# EasyEDA Pro project ProProject_Lm317 powerDesign.epro

# Schematic Schematic1
Create Date: 2024-03-27; Page Name: P1; Project Name: Lm317 powerDesign; Schematic Name: Schematic1; Update Date: 2024-03-28; Company: ZenCoding.lumi; Page Size: A4; Version: V1.0
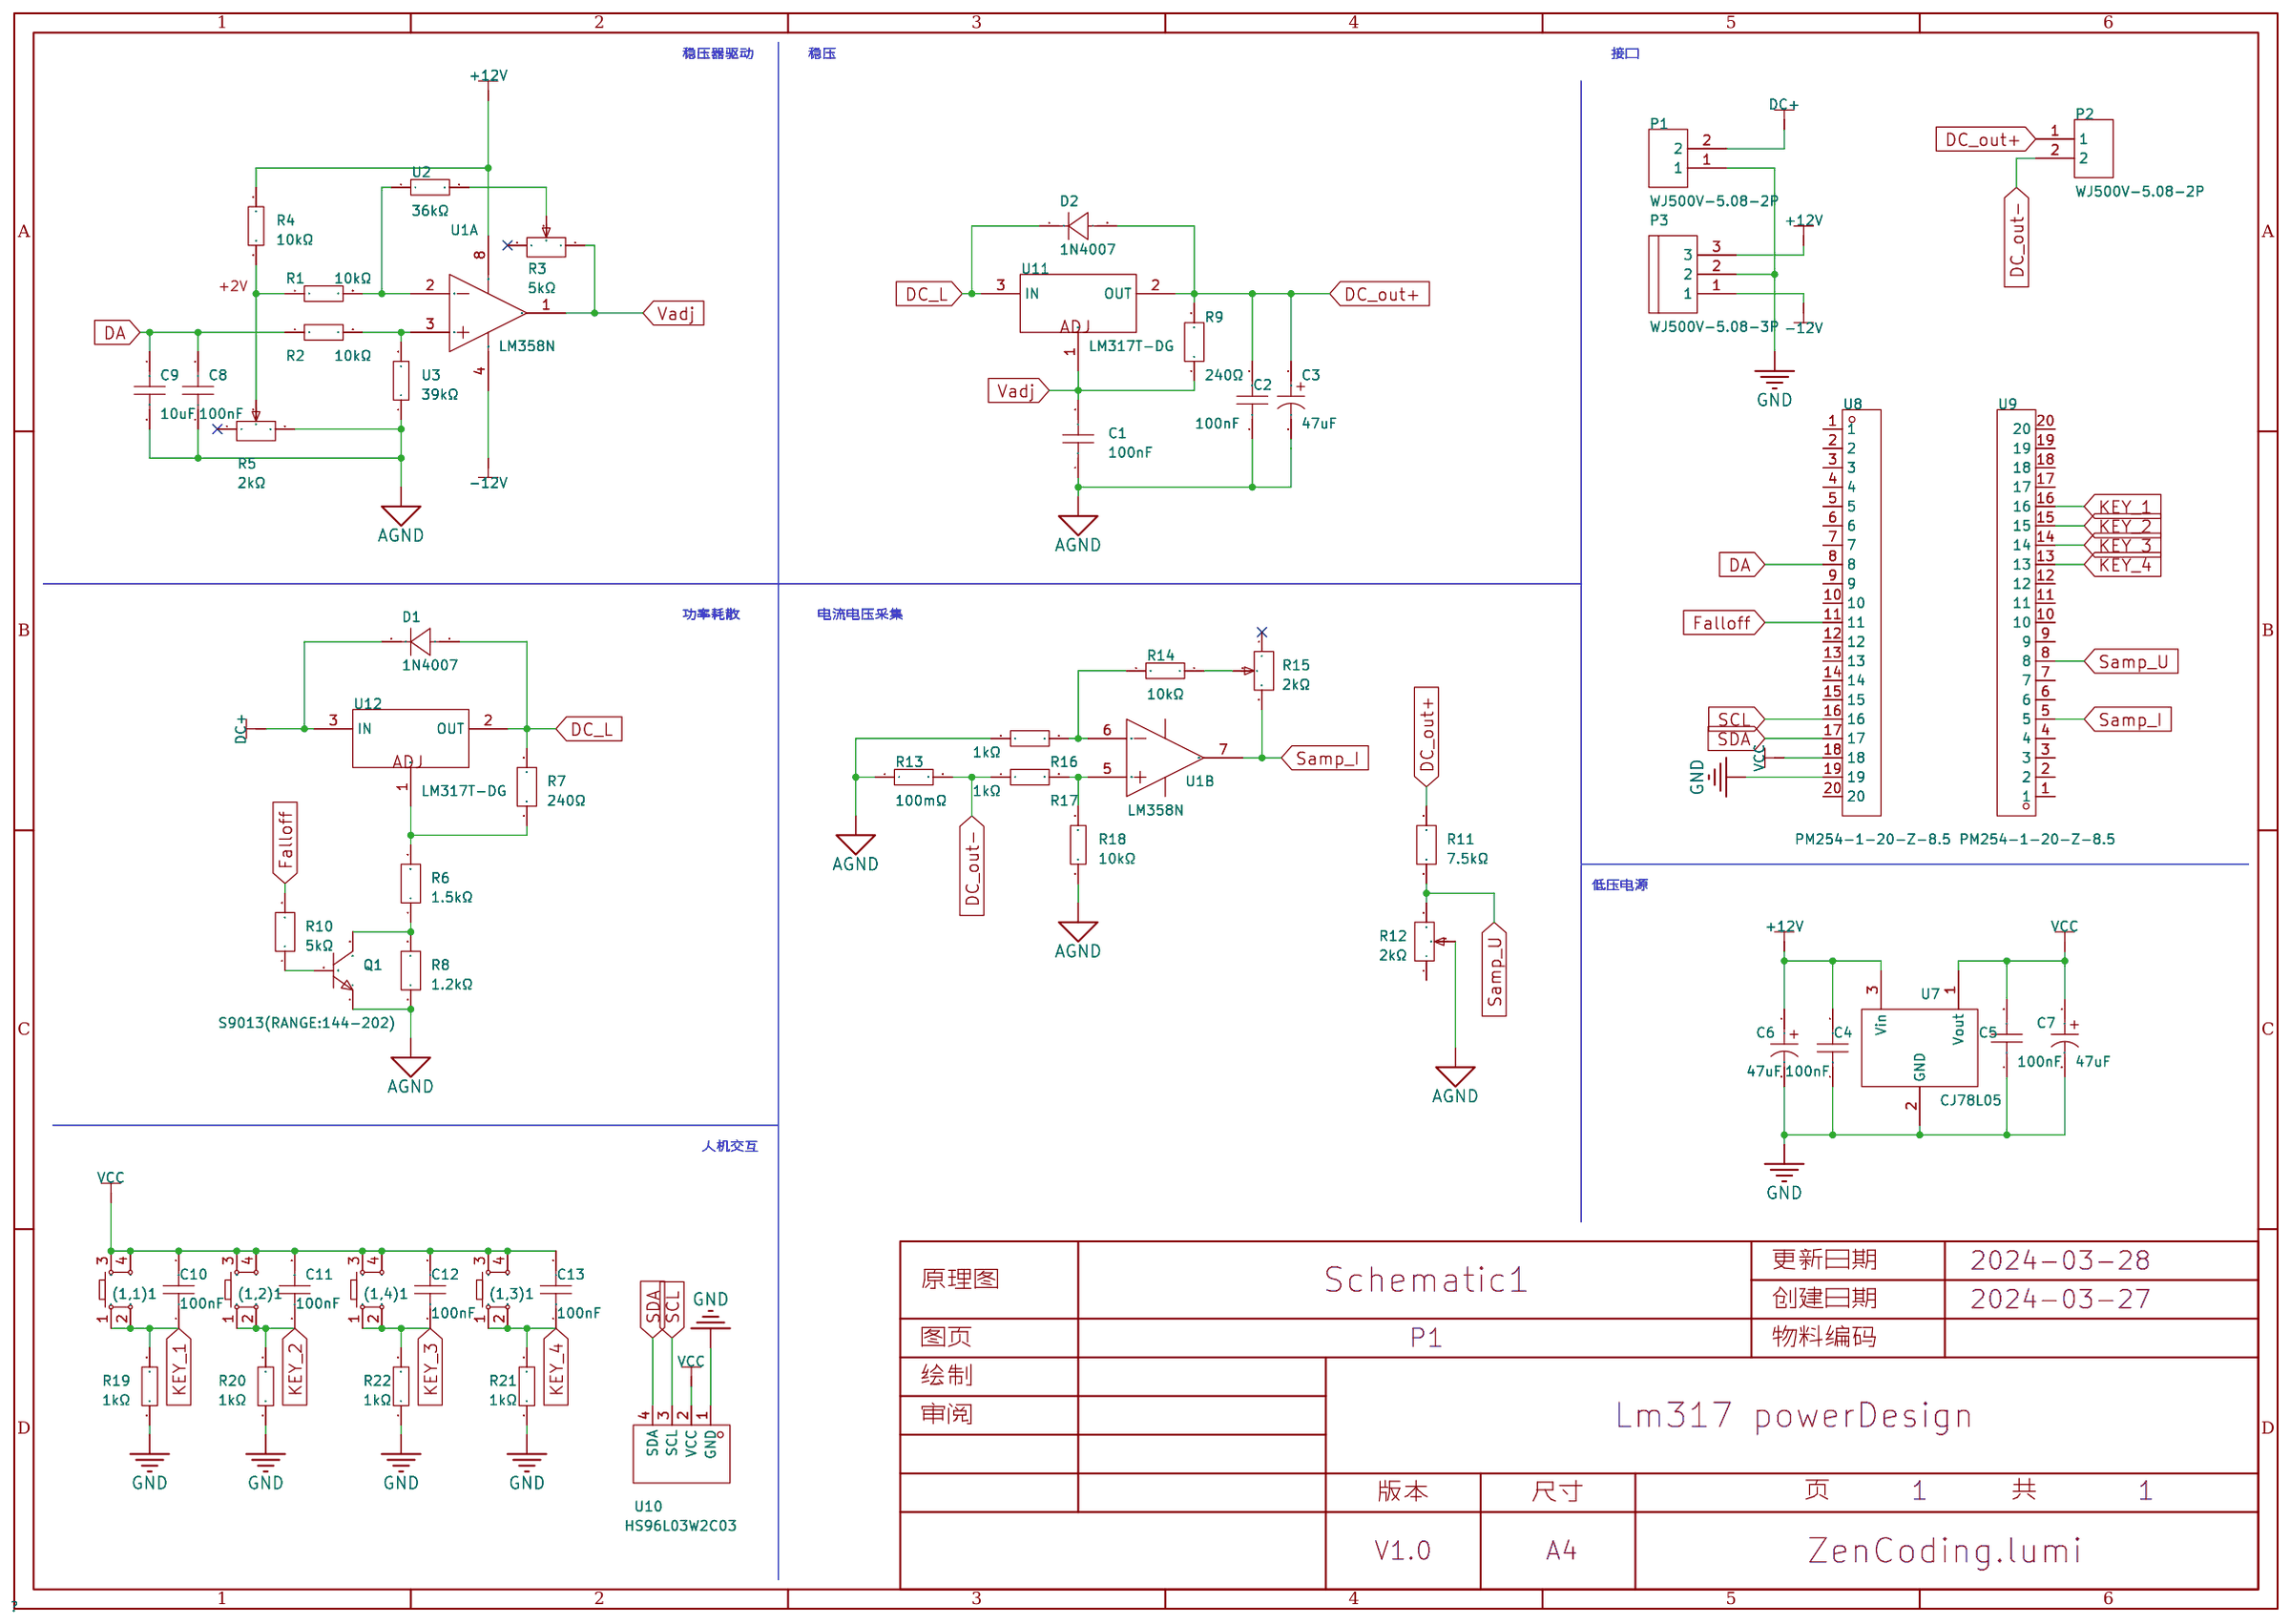
[diagram p0: schematic sheet]

## Parts
(1,1)1  -  [SW-TH_4P-L6.0-W6.0-P4.50-LS6.5]
(1,2)1  -  [SW-TH_4P-L6.0-W6.0-P4.50-LS6.5]
(1,3)1  -  [SW-TH_4P-L6.0-W6.0-P4.50-LS6.5]
(1,4)1  -  [SW-TH_4P-L6.0-W6.0-P4.50-LS6.5]
C1  100nF  [CAP-TH_L5.0-W2.5-P5.08-D0.7]
C2  100nF  [CAP-TH_L13.0-W6.0-P10.00-D0.6]
C3  47uF  [CAP-TH_BD6.3-P3.50-D0.5-FD]
C4  100nF  [CAP-TH_L5.0-W2.5-P5.08-D0.7]
C5  100nF  [CAP-TH_L5.0-W2.5-P5.08-D0.7]
C6  47uF  [CAP-TH_BD6.3-P3.50-D0.5-FD]
C7  47uF  [CAP-TH_BD6.3-P3.50-D0.5-FD]
C8  100nF  [CAP-TH_L5.0-W2.5-P5.08-D0.7]
C9  10uF  [CAP-TH_L5.5-W3.8-P3.50-D0.6]
C10  100nF  [CAP-TH_L5.0-W2.5-P5.08-D0.7]
C11  100nF  [CAP-TH_L5.0-W2.5-P5.08-D0.7]
C12  100nF  [CAP-TH_L5.0-W2.5-P5.08-D0.7]
C13  100nF  [CAP-TH_L5.0-W2.5-P5.08-D0.7]
D1  1N4007  [DO-41_BD2.4-L4.7-P8.70-D0.8-RD]
D2  1N4007  [DO-41_BD2.4-L4.7-P8.70-D0.8-RD]
P1  WJ500V-5.08-2P  [CONN-TH_2P-P5.00_WJ500V-5.08-2P]
P2  WJ500V-5.08-2P  [CONN-TH_2P-P5.00_WJ500V-5.08-2P]
P3  WJ500V-5.08-3P  [CONN-TH_3P-P5.00_WJ500V-5.08-3P]
Q1  S9013(RANGE:144-202)  [TO-92-3_L4.9-W3.7-P1.27-L]
R1  10kΩ  [RES-TH_BD2.4-L6.3-P10.30-D0.6]
R2  10kΩ  [RES-TH_BD2.4-L6.3-P10.30-D0.6]
R3  5kΩ  [RES-ADJ-TH_3296W]
R4  10kΩ  [RES-TH_BD2.4-L6.3-P10.30-D0.6]
R5  2kΩ  [RES-ADJ-TH_3296W]
R6  1.5kΩ  [RES-TH_BD2.7-L6.2-P10.20-D0.4]
R7  240Ω  [RES-TH_BD3.5-L9.0-P13.00-D0.5]
R8  1.2kΩ  [RES-TH_BD2.3-L6.5-P10.50-D0.5]
R9  240Ω  [RES-TH_BD3.5-L9.0-P13.00-D0.5]
R10  5kΩ  [RES-TH_BD4.5-L11.5-P15.50-D0.8]
R11  7.5kΩ  [RES-TH_BD2.3-L6.5-P10.50-D0.5]
R12  2kΩ  [RES-ADJ-TH_3296W]
R13  100mΩ  [R2512]
R14  10kΩ  [RES-TH_BD2.4-L6.3-P10.30-D0.6]
R15  2kΩ  [RES-ADJ-TH_3296W]
R16  1kΩ  [RES-TH_BD2.5-L6.5-P10.50-D0.6]
R17  1kΩ  [RES-TH_BD2.5-L6.5-P10.50-D0.6]
R18  10kΩ  [RES-TH_BD2.4-L6.3-P10.30-D0.6]
R19  1kΩ  [RES-TH_BD2.5-L6.5-P10.50-D0.6]
R20  1kΩ  [RES-TH_BD2.5-L6.5-P10.50-D0.6]
R21  1kΩ  [RES-TH_BD2.5-L6.5-P10.50-D0.6]
R22  1kΩ  [RES-TH_BD2.5-L6.5-P10.50-D0.6]
U1  LM358N  [DIP-8_L9.2-W6.3-P2.54-LS7.62-BL]  (sections 1,2)
U2  36kΩ  [RES-TH_BD2.7-L6.2-P10.20-D0.4]
U3  39kΩ  [RES-TH_BD2.7-L6.2-P10.20-D0.4]
U7  CJ78L05  [TO-92-3_L4.9-W3.7-P1.27-L]
U8  PM254-1-20-Z-8.5  [HDR-TH_20P-P2.54-V-F-2]
U9  PM254-1-20-Z-8.5  [HDR-TH_20P-P2.54-V-F-2]
U10  HS96L03W2C03  [OLED-TH_L27.8-W27.2-P2.54_C9900033791]
U11  LM317T-DG  [TO-220-3_L10.0-W4.5-P2.54-L]
U12  LM317T-DG  [TO-220-3_L10.0-W4.5-P2.54-L]

## Library data of the parts
(1,1)1 (1,2)1 (1,3)1 (1,4)1 = Key_TH_6x6x6: 触点电流:50mA;额定电压(DC):12V;绝缘电阻:100MΩ;电路结构:单刀单掷;安装方式:直插;按钮形状:圆形按钮;按钮/盖帽颜色:黑色;作用力:260gf@±30gf;工作温度:-25℃~+70℃;引脚样式:PC引脚;开关长度:6mm;开关宽度:6mm;开关高度:6mm;带支架:否;; Supplier Part: C2837516; Supplier Footprint: 插件
C1 C4 C5 C8 C10-C13 = CC2A104ZC1ID3F7C30MF: 容值:100nF;精度:-20%~+80%;额定电压:100V;温度系数:Y5V;; LCSC Part Name: 100nF -20%~+80% 100V; Supplier Part: C254109; Manufacturer: Dersonic(德尔创); Supplier Footprint: 插件,P=5.08mm; JLCPCB Part Class: 扩展库; Datasheet: https://atta.szlcsc.com/upload/public/pdf/source/20200826/C254109_69B66F26D881BAFE780345BC7E166D34.pdf; Supplier: LCSC; Tolerance: -20%~+80%; Voltage Rated: 100V; Lead Spacing: 5.08mm; Temperature Coefficient: Y5V; φD: 7mm; Body Thickness: 2.2mm
C2 = MPX104K31C3KN15600: 容值:100nF;精度:±10%;电压(AC):275V；310V；305V;等级:X2;; LCSC Part Name: 100nF ±10% 275V 305V 310V 等级:X2; Supplier Part: C489079; Manufacturer: KNSCHA(科尼盛); Supplier Footprint: 插件,P=10mm; JLCPCB Part Class: 扩展库; Datasheet: https://atta.szlcsc.com/upload/public/pdf/source/20200225/C489079_75CB6A5338414DC85C4C6073302579B5.pdf; Supplier: LCSC; Tolerance: ±10%; Voltage(AC): 275V；310V；305V; Subclass: X2; safety certification: UL；CUL；KC；ENEC；VDE；CQC; Operating Temperature: -40℃~+110℃
C3 C6 C7 = 03EC0571: 容值:47uF;精度:±20%;额定电压:50V;纹波电流:180mA@100kHz;等效串联电阻:-;; LCSC Part Name: 47uF ±20% 50V; Supplier Part: C2831773; Manufacturer: KNSCHA(科尼盛); Supplier Footprint: 插件,D6.3xL12mm; JLCPCB Part Class: 扩展库; Datasheet: https://atta.szlcsc.com/upload/public/pdf/source/20210511/C2831773_B2DD61C1D939670FA320BC15BC6C3610.pdf; Supplier: LCSC; Tolerance: ±20%; Rated Voltage: 50V; Ripple Current: 180mA@100kHz; Lead Spacing: 3.5mm; φD: 6.3mm; L: 12mm; Lifetime @ Temp: 2000hrs@105℃; Operating Temperature: -40℃~+105℃
C9 = CD1E106MC9BER2F100: 容值:10uF;精度:±20%;额定电压:25V;温度系数:X5R;; LCSC Part Name: 10uF ±20% 25V; Supplier Part: C2761733; Manufacturer: Dersonic(德尔创); Supplier Footprint: 插件,P=5.08mm; JLCPCB Part Class: 扩展库; Datasheet: https://atta.szlcsc.com/upload/public/pdf/source/20210512/C2761733_48A4F8FFA54EF14BEC181E01EC41507A.pdf; Supplier: LCSC; Tolerance: ±20%; Voltage Rated: 25V; Temperature Coefficient: X5R
D1 D2 = 1N4007_C2985028: 正向压降(Vf):1V@1A;直流反向耐压(Vr):1kV;平均整流电流(Io):1A;; LCSC Part Name: 电压:1kV 电流:1A; Supplier Part: C2985028; Manufacturer: GOODWORK(固得沃克); Supplier Footprint: DO-41; JLCPCB Part Class: 扩展库; Datasheet: https://atta.szlcsc.com/upload/public/pdf/source/20210723/C2848669_ECFE0BC1B34B7BAAA686846FF0F306A7.pdf; Supplier: LCSC; Forward Voltage (Vf@If): 1V@1A; Reverse Voltage (Vr): 1kV; Average Rectified Current (Io): 1A
P1 P2 = WJ500V-5.08-2P: 结构:1x2P;间距:5.08mm;颜色:绿色;安装方式:直插;额定电流:18A;额定电压:250V;排数:1;线规 - AWG:14~30;线规 - 平方毫米:2.5;每排PIN数:2;工作温度范围:-40℃~+105℃;; LCSC Part Name: 5.08mm 1x2P 排数:1 每排P数:2 直插; Supplier Part: C8465; Manufacturer: KANGNEX(康奈克斯电气); Supplier Footprint: 插件,P=5.08mm; JLCPCB Part Class: 扩展库; Datasheet: https://atta.szlcsc.com/upload/public/pdf/source/20191225/C8465_02D34CE5B5B4A53DF5891601D97FA9F4.pdf; Supplier: LCSC; Structure: 1x2P; Pitch: 5.08mm; Color: 绿色; Mounting Style: 直插; Current Rating (Max): 18A; Voltage Rating (Max): 250V; Number of Pins: 2P; Number of Rows: 1; Wire Gauge - AWG: 14~30; Wire Gauge - mm2: 2.5; Number of PINs Per Row: 2; Operating Temperature Range: -40℃~+105℃
P3 = WJ500V-5.08-3P: 结构:1x3P;间距:5.08mm;颜色:绿色;安装方式:直插;额定电流:18A;额定电压:250V;排数:1;线规 - AWG:14~30;线规 - 平方毫米:2.5;每排PIN数:3;工作温度范围:-40℃~+105℃;; LCSC Part Name: 5.08mm 1x3P 排数:1 每排P数:3 直插; Supplier Part: C72334; Manufacturer: KANGNEX(康奈克斯电气); Supplier Footprint: 插件,P=5.08mm; JLCPCB Part Class: 扩展库; Datasheet: https://atta.szlcsc.com/upload/public/pdf/source/20191225/C72334_8A5EF831D67650233B6B1E3F2BC06274.pdf; Supplier: LCSC; Structure: 1x3P; Pitch: 5.08mm; Color: 绿色; Mounting Style: 直插; Current Rating (Max): 18A; Voltage Rating (Max): 250V; Number of Pins: 3P; Number of Rows: 1; Wire Gauge - AWG: 14~30; Wire Gauge - mm2: 2.5; Number of PINs Per Row: 3; Operating Temperature Range: -40℃~+105℃
Q1 = S9013(RANGE:144-202): 晶体管类型:NPN;集电极电流(Ic):500mA;集射极击穿电压(Vceo):25V;功率(Pd):625mW;; LCSC Part Name: 耐压:25V 电流:500mA NPN H档; Supplier Part: C16066; Manufacturer: CJ(江苏长电/长晶); Supplier Footprint: TO-92-3; JLCPCB Part Class: 扩展库; Datasheet: https://atta.szlcsc.com/upload/public/pdf/source/20130730/1457706627832.pdf; Supplier: LCSC; Transistor Type: NPN; Collector Current (Ic): 500mA; Collector-Emitter Breakdown Voltage (Vceo): 25V; Power Dissipation (Pd): 625mW
R1 R2 R4 R14 R18 = MFR-25FTE52-10K: 电阻类型:金属膜电阻;阻值:10kΩ;精度:±1%;功率:250mW;温度系数:±50ppm/℃;; LCSC Part Name: 金属膜电阻 10kΩ ±1% 250mW; Supplier Part: C172967; Manufacturer: YAGEO(国巨); Supplier Footprint: 插件,D2.4xL6.3mm; JLCPCB Part Class: 扩展库; Datasheet: https://atta.szlcsc.com/upload/public/pdf/source/20191118/C457825_18355E864DE4965678DC27B0EBC3E21E.pdf; Supplier: LCSC; Type: 金属膜电阻; Tolerance: ±1%; Power(Watts): 250mW; Temperature Coefficient: ±50ppm/℃; Operating Temperature Range: -55℃~+155℃
R3 = 3296W-1-502LF: 阻值:5kΩ;精度:±10%;; LCSC Part Name: 5kΩ ±10%; Supplier Part: C60620; Manufacturer: BOURNS; Supplier Footprint: 插件; JLCPCB Part Class: 扩展库; Datasheet: https://atta.szlcsc.com/upload/public/pdf/source/20180326/C111793_7BE3639881F18EA7BF3D269EDA80A489.pdf; Supplier: LCSC; Tolerance: ±10%
R5 R12 R15 = 3296W-1-202LF: 阻值:2kΩ;精度:±10%;; LCSC Part Name: 2kΩ ±10%; Supplier Part: C83684; Manufacturer: BOURNS; Supplier Footprint: 插件; JLCPCB Part Class: 扩展库; Datasheet: https://atta.szlcsc.com/upload/public/pdf/source/20180326/C111793_7BE3639881F18EA7BF3D269EDA80A489.pdf; Supplier: LCSC; Tolerance: ±10%
R6 = CR1/4W-1K5±5%-ST52: 电阻类型:碳膜电阻;阻值:1.5kΩ;精度:±5%;功率:250mW;温度系数:±350ppm/℃;; LCSC Part Name: 碳膜电阻 1.5kΩ ±5% 250mW; Supplier Part: C2894662; Manufacturer: VO(翔胜); Supplier Footprint: 插件,2.7x6.2mm; JLCPCB Part Class: 扩展库; Datasheet: https://atta.szlcsc.com/upload/public/pdf/source/20210803/C2857407_45FF53FE186CAB545115AD37303966CD.pdf; Supplier: LCSC; Type: 碳膜电阻; Tolerance: ±5%; Overload Voltage (Max): 250V; Power(Watts): 250mW; Temperature Coefficient: ±350ppm/℃; Operating Temperature Range: -55℃~+155℃
R7 R9 = CR1/2WS-240Ω±5%-ST52: 电阻类型:碳膜电阻;阻值:240Ω;精度:±5%;功率:500mW;温度系数:±350ppm/℃;; LCSC Part Name: 碳膜电阻 240Ω ±5% 500mW; Supplier Part: C2894644; Manufacturer: VO(翔胜); Supplier Footprint: 插件,D2.7xL6.2mm; JLCPCB Part Class: 扩展库; Datasheet: https://atta.szlcsc.com/upload/public/pdf/source/20210803/C2857407_45FF53FE186CAB545115AD37303966CD.pdf; Supplier: LCSC; Type: 碳膜电阻; Tolerance: ±5%; Overload Voltage (Max): 350V; Power(Watts): 500mW; Temperature Coefficient: ±350ppm/℃; Operating Temperature Range: -55℃~+155℃
R8 = MF1/4W-1.2KΩ±1%T52: 电阻类型:金属膜电阻;阻值:1.2kΩ;精度:±1%;功率:250mW;温度系数:±200ppm/℃;; LCSC Part Name: 金属膜电阻 1.2kΩ ±1% 250mW; Supplier Part: C713998; Manufacturer: 华星机电; Supplier Footprint: 插件; JLCPCB Part Class: 扩展库; Datasheet: https://atta.szlcsc.com/upload/public/pdf/source/20200731/C713882_AE8EB1102749D7E4FB4FB13DC898C429.pdf; Supplier: LCSC; Type: 金属膜电阻; Tolerance: ±1%; Power(Watts): 250mW; Temperature Coefficient: ±200ppm/℃
R10 = MFR100FTE73-5K: 电阻类型:金属膜电阻;阻值:5kΩ;精度:±1%;功率:1W;温度系数:±50ppm/℃;; LCSC Part Name: 金属膜电阻 5kΩ ±1% 1W; Supplier Part: C2838701; Manufacturer: YAGEO(国巨); Supplier Footprint: 插件,4.5x11.5mm; JLCPCB Part Class: 扩展库; Datasheet: https://atta.szlcsc.com/upload/public/pdf/source/20220113/6D33C91FDFACEAAC0A62ED46CF46C6E2.pdf; Supplier: LCSC; Type: 金属膜电阻; Tolerance: ±1%; Power(Watts): 1W; Temperature Coefficient: ±50ppm/℃; Operating Temperature Range: -55℃~+155℃
R11 = RN1/2WS7.5KΩFT/BA1: 电阻类型:金属膜电阻;阻值:7.5kΩ;精度:±1%;功率:500mW;温度系数:±50ppm/℃;; LCSC Part Name: 7.5kΩ ±1% 500mW 金属膜电阻; Supplier Part: C385543; Manufacturer: Tyohm(幸亚电阻); Supplier Footprint: 插件; JLCPCB Part Class: 扩展库; Datasheet: https://atta.szlcsc.com/upload/public/pdf/source/20191008/C433681_B72693A7FD256E0D1DC5EFE3F095EED3.pdf; Supplier: LCSC; Type: 金属膜电阻; Tolerance: ±1%; Power(Watts): 500mW; Temperature Coefficient: ±50ppm/℃
R13 = RLP25FEER100: 阻值:100mΩ;精度:±1%;功率:2W;温度系数:±50ppm/℃;; LCSC Part Name: 100mΩ ±1% 2W; Supplier Part: C160587; Manufacturer: 大毅科技; Supplier Footprint: 2512; JLCPCB Part Class: 扩展库; Datasheet: https://atta.szlcsc.com/upload/public/pdf/source/20191209/C467441_D59F70B0A5C6980F35DB1CB3CCA97CC4.pdf; Supplier: LCSC; Tolerance: ±1%; Power(Watts): 2W; Temperature Coefficient: ±50ppm/℃
R16 R17 R19-R22 = MFR0W4F1001A50: 电阻类型:金属膜电阻;阻值:1kΩ;精度:±1%;功率:250mW;温度系数:±50ppm/℃;; LCSC Part Name: 1kΩ ±1% 250mW 金属膜电阻; Supplier Part: C57435; Manufacturer: UNI-ROYAL(厚声); Supplier Footprint: 插件; JLCPCB Part Class: 扩展库; Datasheet: https://atta.szlcsc.com/upload/public/pdf/source/20191012/C436293_8820AA14BC71FA35E551C06C441482A0.pdf; Supplier: LCSC; Type: 金属膜电阻; Tolerance: ±1%; Overload Voltage (Max): 250V; Power(Watts): 250mW; Temperature Coefficient: ±50ppm/℃
U1 = LM358N: 放大器数:-;; Supplier Part: C434570; Manufacturer: HGSEMI(华冠); Supplier Footprint: DIP-8; JLCPCB Part Class: 扩展库; Datasheet: https://atta.szlcsc.com/upload/public/pdf/source/20201104/C398078_C03AD53C2769C23315C184712D62478F.pdf; Supplier: LCSC
U2 = MF1/4W-36K±1%-ST52: 电阻类型:金属膜电阻;阻值:36kΩ;精度:±1%;功率:250mW;温度系数:±350ppm/℃;; LCSC Part Name: 金属膜电阻 36kΩ ±1% 250mW; Supplier Part: C2848587; Manufacturer: VO(翔胜); Supplier Footprint: 插件,2.7x6.2mm; JLCPCB Part Class: 扩展库; Supplier: LCSC; Type: 金属膜电阻; Tolerance: ±1%; Overload Voltage (Max): 250V; Power(Watts): 250mW; Temperature Coefficient: ±350ppm/℃; Operating Temperature Range: -55℃~+155℃
U3 = CR1/4W-39K±5%-ST26: 电阻类型:碳膜电阻;阻值:39kΩ;精度:±5%;功率:250mW;温度系数:±350ppm/℃;; LCSC Part Name: 碳膜电阻 39kΩ ±5% 250mW; Supplier Part: C2894635; Manufacturer: VO(翔胜); Supplier Footprint: 插件,2.7x6.2mm; JLCPCB Part Class: 扩展库; Datasheet: https://atta.szlcsc.com/upload/public/pdf/source/20210803/C2857407_45FF53FE186CAB545115AD37303966CD.pdf; Supplier: LCSC; Type: 碳膜电阻; Tolerance: ±5%; Overload Voltage (Max): 250V; Power(Watts): 250mW; Temperature Coefficient: ±350ppm/℃; Operating Temperature Range: -55℃~+155℃
U7 = CJ78L05_C8608: 输出类型:固定;最大输入电压:30V;输出电压:5V;最大输出电流:100mA;输出极性:正极;; LCSC Part Name: 输入30V 输出5V 100mA; Supplier Part: C8608; Manufacturer: CJ(江苏长电/长晶); Supplier Footprint: TO-92-3; JLCPCB Part Class: 扩展库; Datasheet: https://atta.szlcsc.com/upload/public/pdf/source/20140809/1457707216307.pdf; Supplier: LCSC; Output Type: 固定; Maximum Input Voltage: 30V; Output Voltage: 5V; MAX Output Current: 100mA; Dropout Voltage: 1.7V@(40mA); Output Polarity: 正极; Number of Outputs: 1
U8 U9 = PM254-1-20-Z-8.5: 插孔结构:1x20P;间距:2.54mm;行距:-;圆孔/方孔:方孔;安装类型:直插;排数:单排;总孔位数:20P;额定电流:3A;额定电压:-;插孔方向:顶部;塑高:8.5mm;触头材质:铜合金;工作温度范围:-40℃~+105℃;焊接温度(最大值):260℃@5S;; LCSC Part Name: 1x20P 间距:2.54mm 直插; Supplier Part: C2897383; Manufacturer: HCTL(华灿天禄); Supplier Footprint: 插件,P=2.54mm; JLCPCB Part Class: 扩展库; Datasheet: https://atta.szlcsc.com/upload/public/pdf/source/20230609/534BE42964C679BDE98E061007C4ABD6.pdf; Supplier: LCSC; Holes Structure: 1x20P; Pitch: 2.54mm; Circular Hole / Square Hole: 方孔; Mounting Type: 直插; Number of Rows: 单排; Number of Holes: 20P; Current Rating (Max): 3A; Holes Direction: 顶部; Insulation Height: 8.5mm; Contact Material: 铜合金; Operating Temperature Range: -40℃~+105℃; Soldering Temperature(Max): 260℃@5S
U10 = HS96L03W2C03: 主控芯片:SSD1315;接口类型:I2C;尺寸(inch):0.96;像素分辨率:128x64;; LCSC Part Name: 0.96寸OLED显示屏窄白光IIC; Supplier Part: C5248080; Manufacturer: HS(汉昇); JLCPCB Part Class: 扩展库; Datasheet: https://atta.szlcsc.com/upload/public/pdf/source/20230627/763D01F79A90007632F098068C7C8AD9.pdf; Supplier: LCSC; Main Control Chip: SSD1315; Interface Type: I2C; Size: 0.96; Pixel Resolution: 128x64; Operating Temperature: -40℃~+70℃
U11 U12 = LM317T-DG: 输出类型:可调;最大输入电压:40V;输出电压:1.2V~37V;最大输出电流:1.5A;电源纹波抑制比(PSRR):80dB@(120Hz);输出极性:正极;; LCSC Part Name: ADJ 输入40V 输出1.2V~37V 1.5A; Supplier Part: C18718; Manufacturer: ST(意法半导体); Supplier Footprint: TO-220; JLCPCB Part Class: 扩展库; Datasheet: https://atta.szlcsc.com/upload/public/pdf/source/20131225/1457706663965.pdf; Supplier: LCSC; Output Type: 可调; Maximum Input Voltage: 40V; Output Voltage: 1.2V~37V; MAX Output Current: 1.5A; Power Supply Rejection Ratio (PSRR): 80dB@(120Hz); standby current: 10mA; Operating Temperature: 0℃~+125℃; Output Polarity: 正极; Number of Outputs: 1

## Nets
+12V: C4.2 C6.1 P3.3 R4.1 U1.8(VCC) U7.3(Vin)
-12V: P3.1 U1.4(GND)
AGND: C1.1 C2.1 C3.2 C8.1 C9.2 Q1.1(E) R5.3 R8.1 R12.2 R13.1 R16.1 R18.1 U3.1
GND: C4.1 C5.1 C6.2 C7.2 P1.1 P3.2 R19.1 R20.1 R21.1 R22.1 U7.2(GND) U8.19 U10.1(GND)
VCC: (1,1)1.3 (1,1)1.4 (1,2)1.3 (1,2)1.4 (1,3)1.3 (1,3)1.4 (1,4)1.3 (1,4)1.4 C5.2 C7.1 C10.2 C11.2 C12.2 C13.2 U7.1(Vout) U8.18 U10.2(VCC)
DA: C8.2 C9.1 R2.1 U8.8
DC+: D1.1(K) P1.2 U12.3(IN)
DC_L: D1.2(A) D2.1(K) R7.2 U11.3(IN) U12.2(OUT)
DC_out+: C2.2 C3.1 D2.2(A) P2.1 R9.2 R11.2 U11.2(OUT)
DC_out-: P2.2 R13.2 R17.1
Falloff: R10.2 U8.11
KEY_1: (1,1)1.1 (1,1)1.2 C10.1 R19.2 U9.16
KEY_2: (1,2)1.1 (1,2)1.2 C11.1 R20.2 U9.15
KEY_3: (1,4)1.1 (1,4)1.2 C12.1 R22.2 U9.14
KEY_4: (1,3)1.1 (1,3)1.2 C13.1 R21.2 U9.13
Samp_I: R15.3 U1.7(OU2) U9.5
Samp_U: R11.1 R12.3 U9.8
SCL: U8.16 U10.3(SCL)
SDA: U8.17 U10.4(SDA)
Vadj: C1.2 R3.1 R9.1 U1.1(OUT1) U11.1(ADJ)
$1N626: R1.2 U1.2(IN1-) U2.1
$1N639: R3.2 U2.2
$1N647: R2.2 U1.3(IN1+) U3.2
$1N774: R1.1 R4.2 R5.2
$1N1335: R6.2 R7.1 U12.1(ADJ)
$1N1345: Q1.3(C) R6.1 R8.2
$1N2009: Q1.2(B) R10.1
$1N2771: R14.2 R16.2 U1.6(IN2-)
$1N2773: R17.2 R18.2 U1.5(IN2+)
$1N2854: R14.1 R15.2

Not connected (* = marked no-connect by the designer): R3 3*; R5 1*; R12 1; R15 1*; U8 1 2 3 4 5 6 7 9 10 12 13 14 15 20; U9 1 2 3 4 6 7 9 10 11 12 17 18 19 20

## Notes on the sheet
- 稳压器驱动
- 稳压
- 接口
- +2V
- 功率耗散
- 电流电压采集
- 低压电源
- 人机交互

# Board PCB1
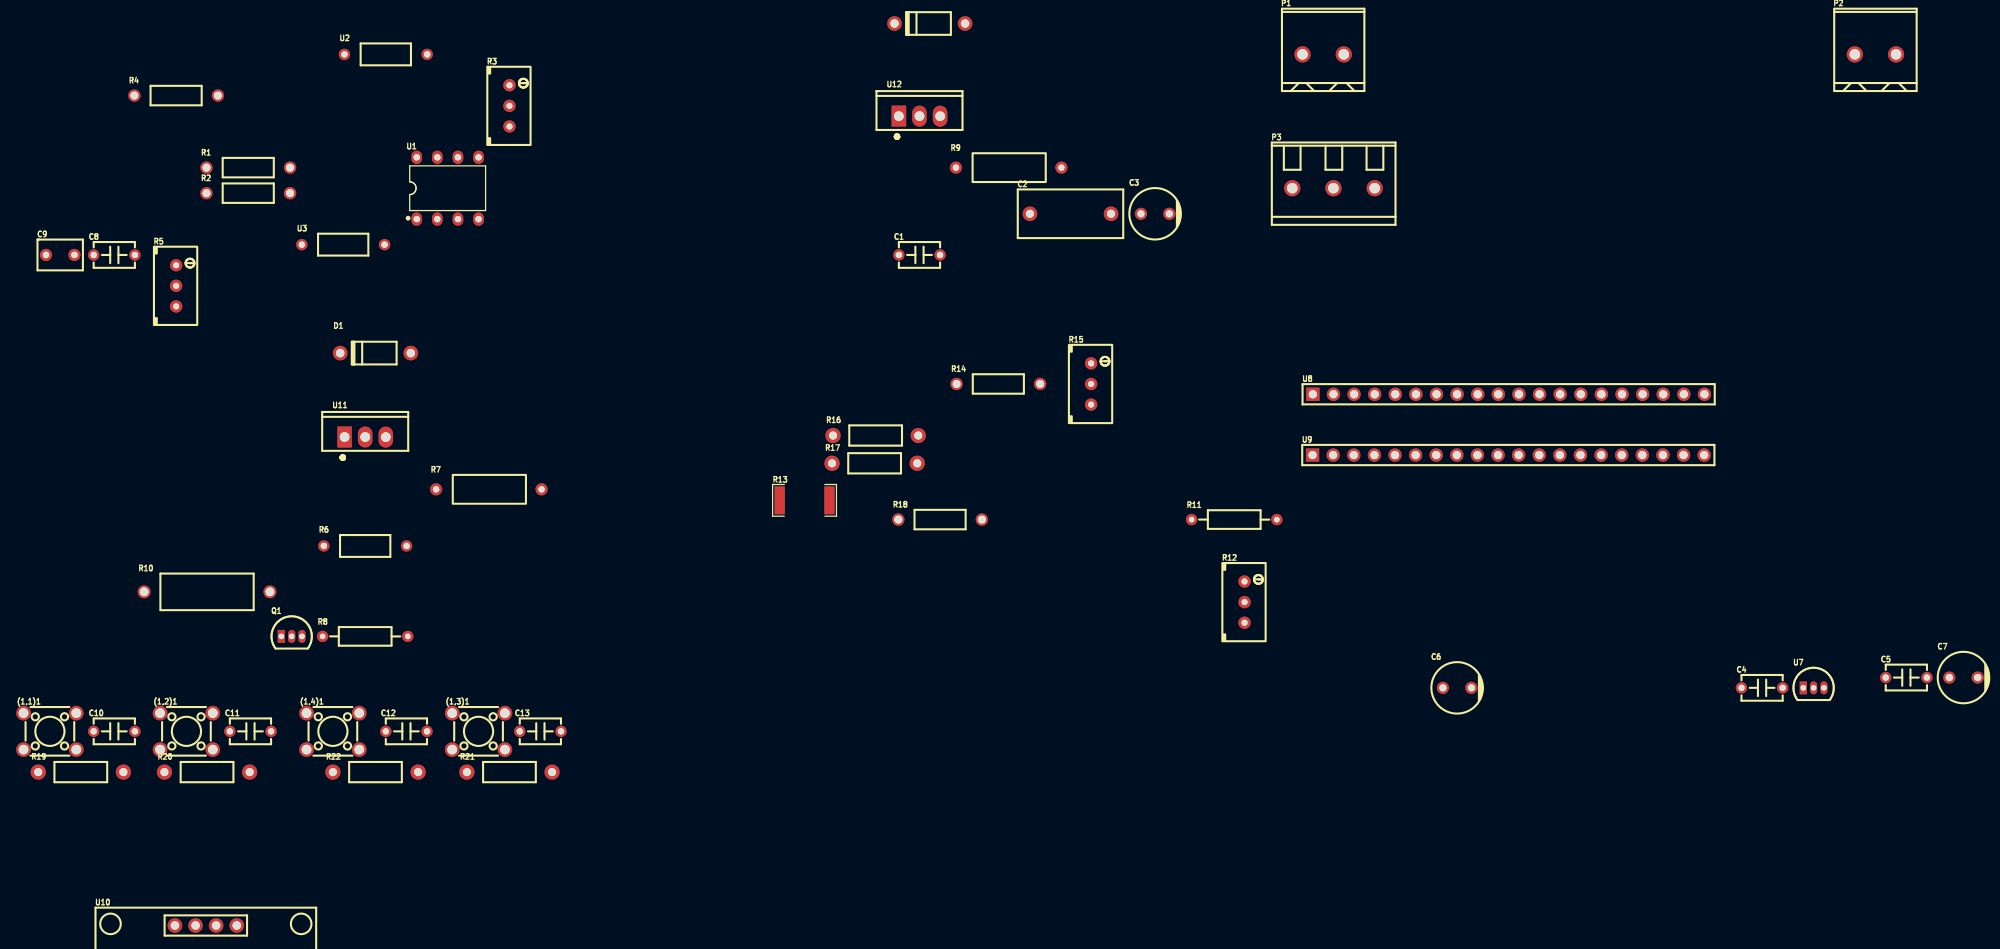
[diagram p1: board, top side]
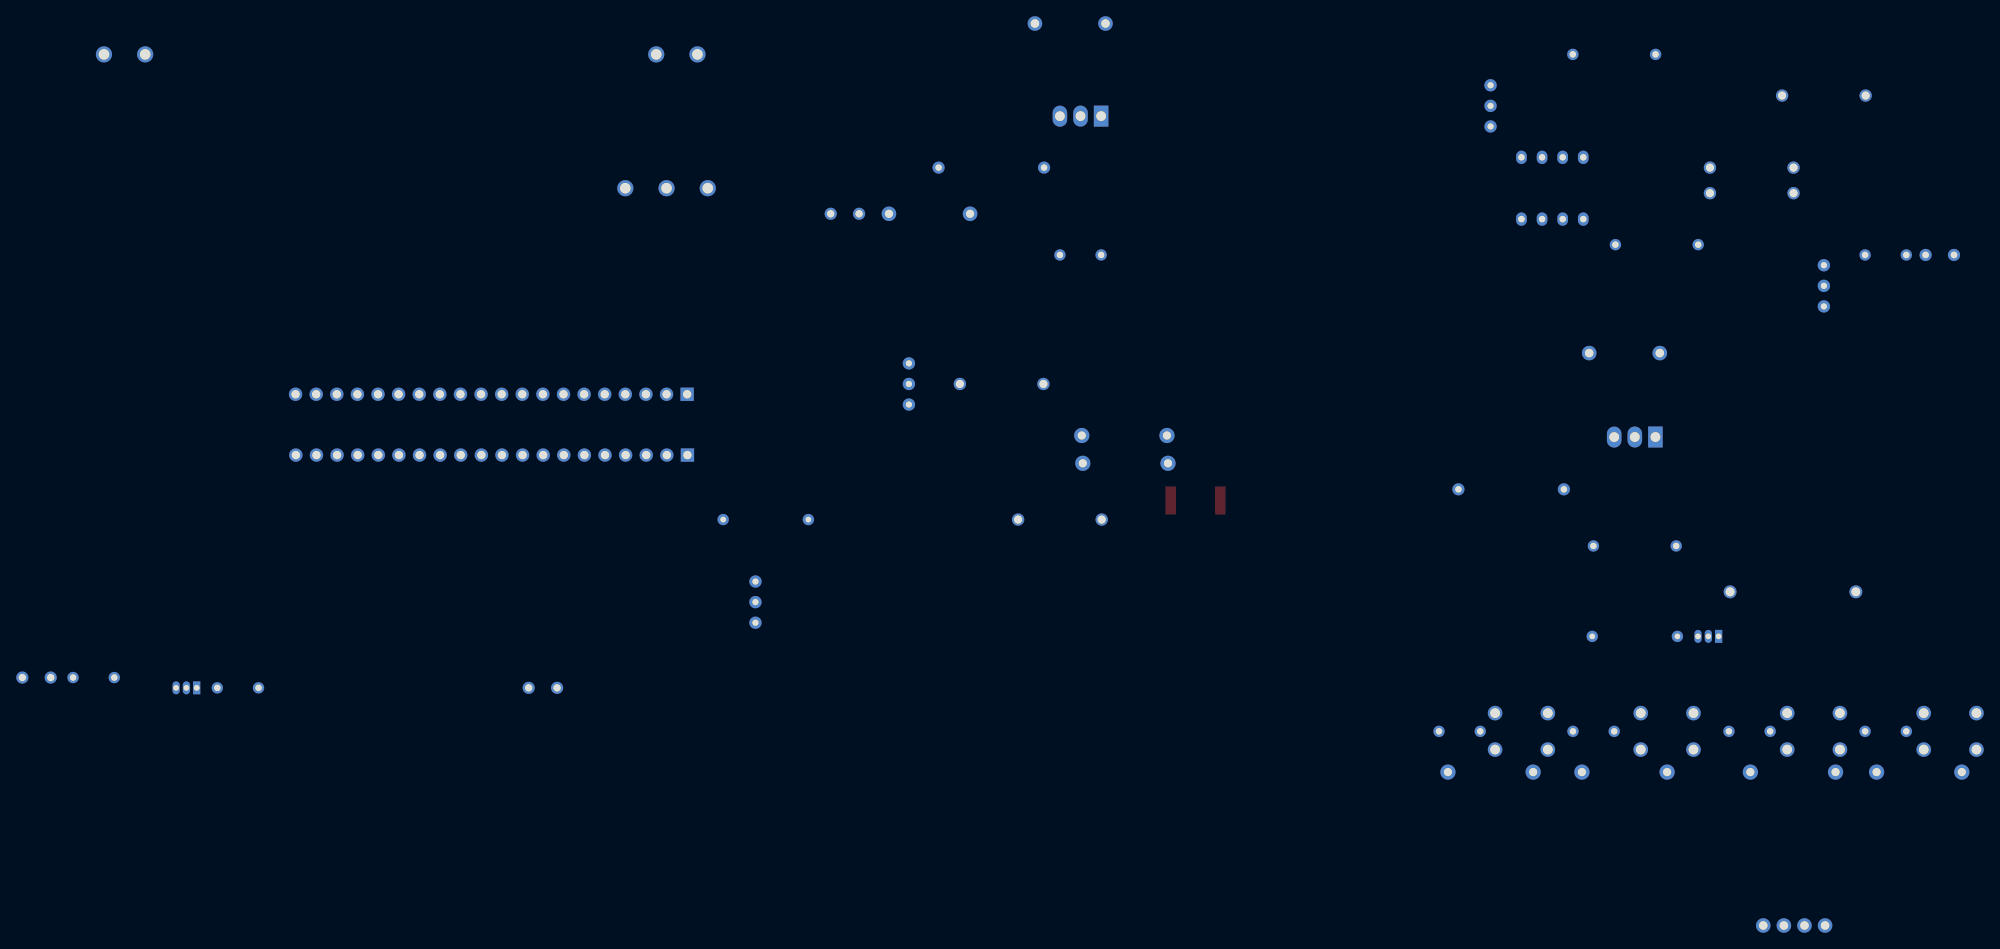
[diagram p2: board, bottom side, seen from below]

No outline. copper layers: Top Layer, Bottom Layer. Coordinates in mm from the lowest, leftmost part position.
Stack: Top Layer 0.035mm / Dielectric1 1.51mm FR4 er 4.5 / Bottom Layer 0.035mm

## Design rules (mm)
template: JLCPCB Capability(Two Layers Board)
spacing copperThickness1oz (default): track to track 0.102, other pairs 0.152 to 0.3
spacing copperThickness2oz: track to track 0.203, other pairs 0.152 to 0.3
track width copperThickness1oz (default): min 0.127, default 0.254, max 2.54
track width copperThickness2oz: min 0.203, default 0.254, max 2.54
differential pair differentialPair (default): width min 0.127, default 0.254, max 2.54; gap min 0.152, default 0.152
via viaSize (default): diameter min 0.5, default 0.61, max 10; hole min 0.3, default 0.305, max 6.3

## Placement (name value [footprint] x y rotation side)
(1,1)1  -  [SW-TH_4P-L6.0-W6.0-P4.50-LS6.5]  0 23.95 0 top
(1,2)1  -  [SW-TH_4P-L6.0-W6.0-P4.50-LS6.5]  16.83 23.95 0 top
(1,3)1  -  [SW-TH_4P-L6.0-W6.0-P4.50-LS6.5]  52.83 23.95 0 top
(1,4)1  -  [SW-TH_4P-L6.0-W6.0-P4.50-LS6.5]  34.88 23.95 0 top
C1  100nF  [CAP-TH_L5.0-W2.5-P5.08-D0.7]  107.17 82.73 0 top
C2  100nF  [CAP-TH_L13.0-W6.0-P10.00-D0.6]  125.78 87.81 0 top
C3  47uF  [CAP-TH_BD6.3-P3.50-D0.5-FD]  136.21 87.81 0 top
C4  100nF  [CAP-TH_L5.0-W2.5-P5.08-D0.7]  211.02 29.32 0 top
C5  100nF  [CAP-TH_L5.0-W2.5-P5.08-D0.7]  228.8 30.59 0 top
C6  47uF  [CAP-TH_BD6.3-P3.50-D0.5-FD]  173.43 29.32 0 top
C7  47uF  [CAP-TH_BD6.3-P3.50-D0.5-FD]  235.84 30.59 0 top
C8  100nF  [CAP-TH_L5.0-W2.5-P5.08-D0.7]  7.94 82.73 0 top
C9  10uF  [CAP-TH_L5.5-W3.8-P3.50-D0.6]  1.27 82.73 0 top
C10  100nF  [CAP-TH_L5.0-W2.5-P5.08-D0.7]  7.94 23.95 0 top
C11  100nF  [CAP-TH_L5.0-W2.5-P5.08-D0.7]  24.72 23.95 0 top
C12  100nF  [CAP-TH_L5.0-W2.5-P5.08-D0.7]  43.94 23.95 0 top
C13  100nF  [CAP-TH_L5.0-W2.5-P5.08-D0.7]  60.45 23.95 0 top
D1  1N4007  [DO-41_BD2.4-L4.7-P8.70-D0.8-RD]  40.13 70.62 0 top
D2  1N4007  [DO-41_BD2.4-L4.7-P8.70-D0.8-RD]  108.44 111.28 0 top
P1  WJ500V-5.08-2P  [CONN-TH_2P-P5.00_WJ500V-5.08-2P]  156.92 107.47 0 top
P2  WJ500V-5.08-2P  [CONN-TH_2P-P5.00_WJ500V-5.08-2P]  224.99 107.47 0 top
P3  WJ500V-5.08-3P  [CONN-TH_3P-P5.00_WJ500V-5.08-3P]  158.19 90.96 0 top
Q1  S9013(RANGE:144-202)  [TO-92-3_L4.9-W3.7-P1.27-L]  29.8 35.67 0 top
R1  10kΩ  [RES-TH_BD2.4-L6.3-P10.30-D0.6]  24.45 93.5 0 top
R2  10kΩ  [RES-TH_BD2.4-L6.3-P10.30-D0.6]  24.45 90.35 0 top
R3  5kΩ  [RES-ADJ-TH_3296W]  56.64 101.12 0 top
R4  10kΩ  [RES-TH_BD2.4-L6.3-P10.30-D0.6]  15.56 102.39 0 top
R5  2kΩ  [RES-ADJ-TH_3296W]  15.56 78.92 0 top
R6  1.5kΩ  [RES-TH_BD2.7-L6.2-P10.20-D0.4]  38.86 46.83 0 top
R7  240Ω  [RES-TH_BD3.5-L9.0-P13.00-D0.5]  54.1 53.81 0 top
R8  1.2kΩ  [RES-TH_BD2.3-L6.5-P10.50-D0.5]  38.86 35.67 0 top
R9  240Ω  [RES-TH_BD3.5-L9.0-P13.00-D0.5]  118.16 93.5 0 top
R10  5kΩ  [RES-TH_BD4.5-L11.5-P15.50-D0.8]  19.37 41.17 0 top
R11  7.5kΩ  [RES-TH_BD2.3-L6.5-P10.50-D0.5]  145.96 50.08 0 top
R12  2kΩ  [RES-ADJ-TH_3296W]  147.23 39.9 0 top
R13  100mΩ  [R2512]  93 52.45 0 top
R14  10kΩ  [RES-TH_BD2.4-L6.3-P10.30-D0.6]  116.89 66.81 0 top
R15  2kΩ  [RES-ADJ-TH_3296W]  128.32 66.81 0 top
R16  1kΩ  [RES-TH_BD2.5-L6.5-P10.50-D0.6]  101.77 60.45 0 top
R17  1kΩ  [RES-TH_BD2.5-L6.5-P10.50-D0.6]  101.64 57.02 0 top
R18  10kΩ  [RES-TH_BD2.4-L6.3-P10.30-D0.6]  109.71 50.08 0 top
R19  1kΩ  [RES-TH_BD2.5-L6.5-P10.50-D0.6]  3.81 18.93 0 top
R20  1kΩ  [RES-TH_BD2.5-L6.5-P10.50-D0.6]  19.37 18.93 0 top
R21  1kΩ  [RES-TH_BD2.5-L6.5-P10.50-D0.6]  56.64 18.93 0 top
R22  1kΩ  [RES-TH_BD2.5-L6.5-P10.50-D0.6]  40.13 18.93 0 top
U1  LM358N  [DIP-8_L9.2-W6.3-P2.54-LS7.62-BL]  49.02 90.96 0 top
U2  36kΩ  [RES-TH_BD2.7-L6.2-P10.20-D0.4]  41.4 107.47 0 top
U3  39kΩ  [RES-TH_BD2.7-L6.2-P10.20-D0.4]  36.15 84 0 top
U7  CJ78L05  [TO-92-3_L4.9-W3.7-P1.27-L]  217.37 29.32 0 top
U8  PM254-1-20-Z-8.5  [HDR-TH_20P-P2.54-V-F-2]  179.78 65.54 0 top
U9  PM254-1-20-Z-8.5  [HDR-TH_20P-P2.54-V-F-2]  179.75 58.04 0 top
U10  HS96L03W2C03  [OLED-TH_L27.8-W27.2-P2.54_C9900033791]  19.22 0 0 top
U11  LM317T-DG  [TO-220-3_L10.0-W4.5-P2.54-L]  38.86 60.26 0 top
U12  LM317T-DG  [TO-220-3_L10.0-W4.5-P2.54-L]  107.17 99.85 0 top

## Footprints (pads in the part's own frame, mm; a bottom-side part is the same pattern mirrored in y, then rotated)
CAP-TH_BD6.3-P3.50-D0.5-FD
  round 1.5 hole 0.9: 1(-1.75,0) 2(1.75,0)
CAP-TH_L5.0-W2.5-P5.08-D0.7
  round 1.4 hole 0.8: 1(-2.54,0) 2(2.54,0)
CAP-TH_L5.5-W3.8-P3.50-D0.6
  round 1.5 hole 0.82: 1(-1.75,0) 2(1.75,0)
CAP-TH_L13.0-W6.0-P10.00-D0.6
  round 1.8 hole 1: 1(-5,0) 2(5,0)
CONN-TH_2P-P5.00_WJ500V-5.08-2P
  round 2 hole 1.3: 1(-2.54,0) 2(2.54,0)
CONN-TH_3P-P5.00_WJ500V-5.08-3P
  round 2 hole 1.3: 1(-5.08,0) 2(0,0) 3(5.08,0)
DIP-8_L9.2-W6.3-P2.54-LS7.62-BL
  oval 1.32x1.65 hole 0.8: 1(-3.81,-3.81) 2(-1.27,-3.81) 3(1.27,-3.81) 4(3.81,-3.81) 5(3.81,3.81) 6(1.27,3.81) 7(-1.27,3.81) 8(-3.81,3.81)
DO-41_BD2.4-L4.7-P8.70-D0.8-RD
  round 1.8 hole 1.05: 1(-4.35,0) 2(4.35,0)
HDR-TH_20P-P2.54-V-F-2
  rect 1.65x1.65 hole 1.02: 1(-24.13,0)
  round 1.65 hole 1.02: 2(-21.59,0) 3(-19.05,0) 4(-16.51,0) 5(-13.97,0) 6(-11.43,0) 7(-8.89,0) 8(-6.35,0) 9(-3.81,0) 10(-1.27,0) 11(1.27,0) 12(3.81,0) 13(6.35,0) 14(8.89,0) 15(11.43,0) 16(13.97,0) 17(16.51,0) 18(19.05,0) 19(21.59,0) 20(24.13,0)
OLED-TH_L27.8-W27.2-P2.54_C9900033791
  round 1.8 hole 1.05: 1(-3.81,0) 2(-1.27,0) 3(1.27,0) 4(3.81,0)
R2512
  rect 1.282x3.456 smd: 1(-3.067,0) 2(3.067,0)
RES-ADJ-TH_3296W
  round 1.524 hole 0.762: 1(0,2.54) 2(0,0) 3(0,-2.54)
RES-TH_BD2.3-L6.5-P10.50-D0.5
  round 1.4 hole 0.7: 1(-5.25,0) 2(5.25,0)
RES-TH_BD2.4-L6.3-P10.30-D0.6
  round 1.524 hole 1: 1(-5.15,0) 2(5.15,0)
RES-TH_BD2.5-L6.5-P10.50-D0.6
  round 1.879 hole 1: 1(-5.25,0) 2(5.25,0)
RES-TH_BD2.7-L6.2-P10.20-D0.4
  round 1.4 hole 0.8: 1(-5.1,0) 2(5.1,0)
RES-TH_BD3.5-L9.0-P13.00-D0.5
  round 1.5 hole 0.8: 1(-6.5,0) 2(6.5,0)
RES-TH_BD4.5-L11.5-P15.50-D0.8
  round 1.6 hole 1.1: 1(-7.75,0) 2(7.75,0)
SW-TH_4P-L6.0-W6.0-P4.50-LS6.5
  round 1.8 hole 1.2: 1(-3.25,2.25) 2(3.25,2.25) 3(-3.25,-2.25) 4(3.25,-2.25)
TO-92-3_L4.9-W3.7-P1.27-L
  rect 0.9x1.6 hole 0.7: 1(-1.27,0)
  oval 0.9x1.6 hole 0.7: 2(0,0) 3(1.27,0)
TO-220-3_L10.0-W4.5-P2.54-L
  rect 1.8x2.6 hole 1.2: 1(-2.54,0.005)
  oval 1.8x2.6 hole 1.2: 2(0,0.005) 3(2.54,-0.005)

## Nets
As in the schematic, except:
DC_OUT+: C2.2 C3.1 D2.2 P2.1 R9.2 R11.2 U11.2
DC_OUT-: P2.2 R13.2 R17.1
FALLOFF: R10.2 U8.11
SAMP_I: R15.3 U1.7 U9.5
SAMP_U: R11.1 R12.3 U9.8
VADJ: C1.2 R3.1 R9.1 U1.1 U11.1

Pads without a net: R3 3; R5 1; R12 1; R15 1; U8 1 2 3 4 5 6 7 9 10 12 13 14 15 20; U9 1 2 3 4 6 7 9 10 11 12 17 18 19 20
